# EAGLE schematic hm2_redraw (EAGLE 8.5.1)
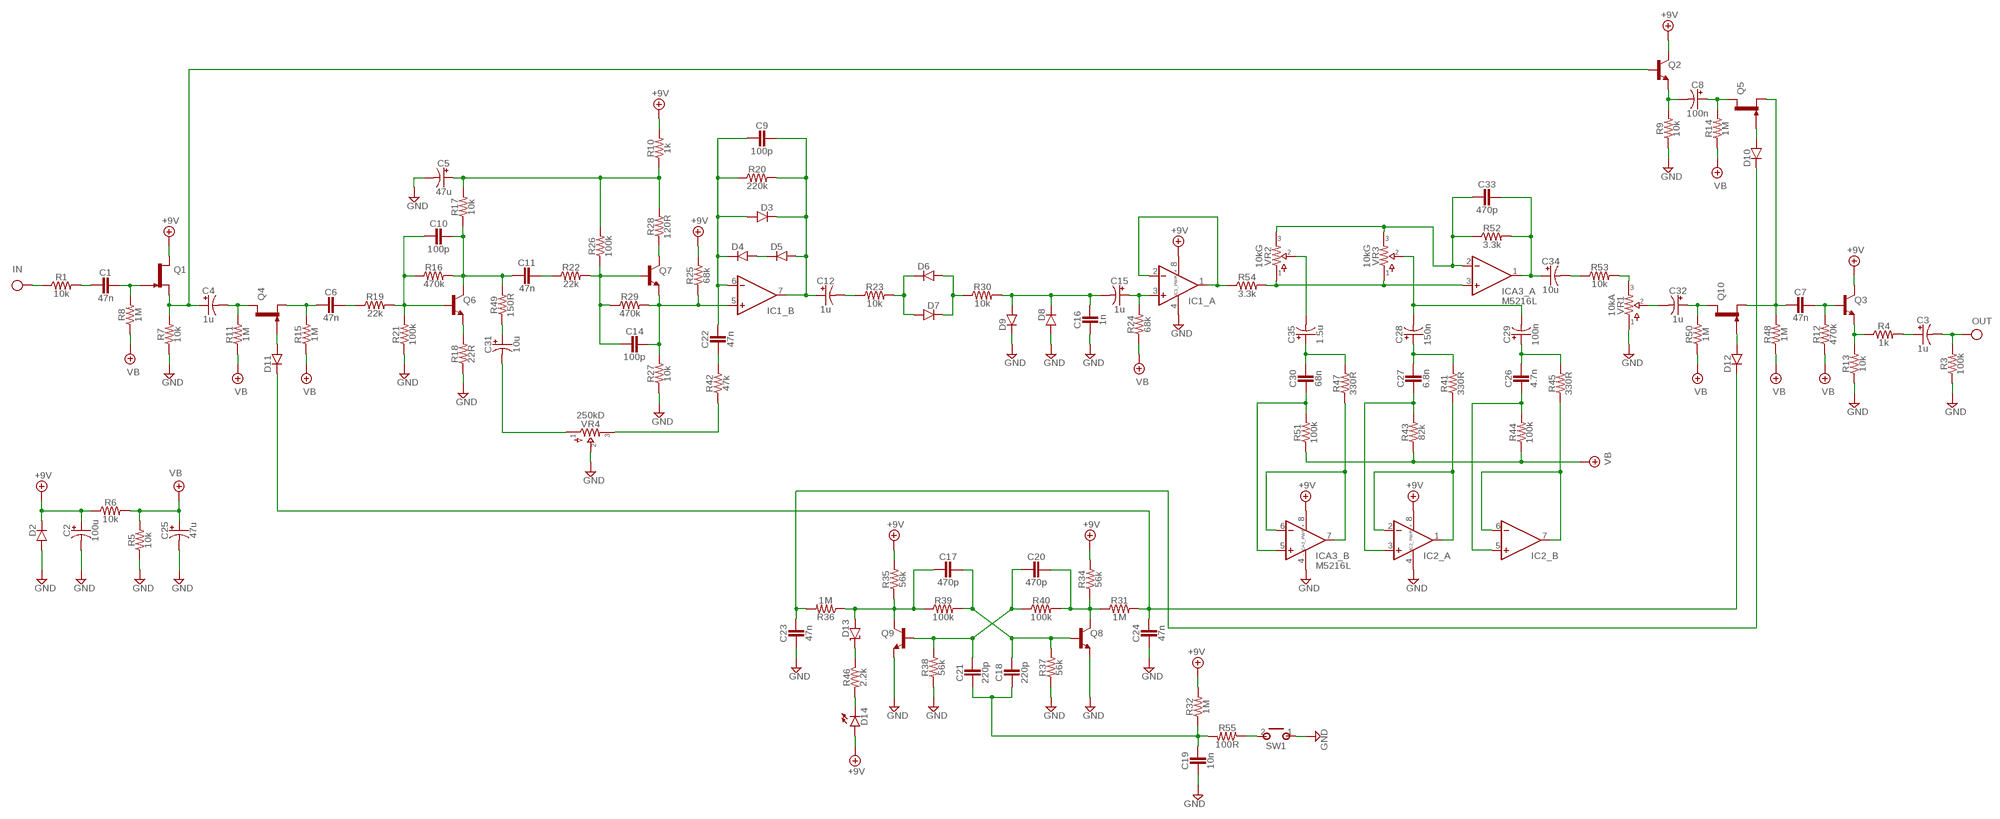
[diagram p0: schematic, sheet 1]

## Parts
C1  47n  CER/FILMBOX.1  [BOX_SMALL]
C2  100u  0400  [040_020]
C3  1u  0400  [040_020]
C4  1u  0400  [040_020]
C5  47u  0400  [040_020]
C6  47n  CER/FILMBOX.1  [BOX_SMALL]
C7  47n  CER/FILMBOX.1  [BOX_SMALL]
C8  100n  0400  [040_020]
C9  100p  CER/FILMBOX.1  [BOX_SMALL]
C10  100p  CER/FILMBOX.1  [BOX_SMALL]
C11  47n  CER/FILMBOX.1  [BOX_SMALL]
C12  1u  0400  [040_020]
C14  100p  CER/FILMBOX.1  [BOX_SMALL]
C15  1u  0400  [040_020]
C16  1n  CER/FILMBOX.1  [BOX_SMALL]
C17  470p  CER/FILMBOX.1  [BOX_SMALL]
C18  220p  CER/FILMBOX.1  [BOX_SMALL]
C19  10n  CER/FILMBOX.1  [BOX_SMALL]
C20  470p  CER/FILMBOX.1  [BOX_SMALL]
C21  220p  CER/FILMBOX.1  [BOX_SMALL]
C22  47n  CER/FILMBOX.1  [BOX_SMALL]
C23  47n  CER/FILMBOX.1  [BOX_SMALL]
C24  47n  CER/FILMBOX.1  [BOX_SMALL]
C25  47u  0400  [040_020]
C26  4.7n  CER/FILMBOX.1  [BOX_SMALL]
C27  6.8n  CER/FILMBOX.1  [BOX_SMALL]
C28  150n  0400  [040_020]
C29  100n  0400  [040_020]
C30  68n  CER/FILMBOX.1  [BOX_SMALL]
C31  10u  0400  [040_020]
C32  1u  0400  [040_020]
C33  470p  CER/FILMBOX.1  [BOX_SMALL]
C34  10u  0400  [040_020]
C35  1.5u  0400  [040_020]
D2  DO35.2  [DO35-2]
D3  DO35.2  [DO35-2]
D4  DO35.2  [DO35-2]
D5  DO35.2  [DO35-2]
D6  DO35.2  [DO35-2]
D7  DO35.2  [DO35-2]
D8  DO35.2  [DO35-2]
D9  DO35.2  [DO35-2]
D10  DO35.2  [DO35-2]
D11  DO35.2  [DO35-2]
D12  DO35.2  [DO35-2]
D13  ZENER.2  [DO41-2]
D14  LED  [3MM_D]
IC1  DUALTH  [DIL0]
IC2  DUALTH  [DIL0]
ICA3  M5216L  DUALTH  [DIL0]
Q1  2N5457  [TO92-]
Q2  2SC828A  [TO92-]
Q3  2SC828A  [TO92-]
Q4  2N5457  [TO92-]
Q5  2N5457  [TO92-]
Q6  2SC828A  [TO92-]
Q7  2SC828A  [TO92-]
Q8  2SC828A  [TO92-]
Q9  2SC828A  [TO92-]
Q10  2N5457  [TO92-]
R1  10k  R_.3B  [R0207/3]
R3  100k  R_.3B  [R0207/3]
R4  1k  R_.3B  [R0207/3]
R5  10k  R_.3B  [R0207/3]
R6  10k  R_.3B  [R0207/3]
R7  10k  R_.3B  [R0207/3]
R8  1M  R_.3B  [R0207/3]
R9  10k  R_.3B  [R0207/3]
R10  1k  R_.3B  [R0207/3]
R11  1M  R_.3B  [R0207/3]
R12  470k  R_.3B  [R0207/3]
R13  10k  R_.3B  [R0207/3]
R14  1M  R_.3B  [R0207/3]
R15  1M  R_.3B  [R0207/3]
R16  470k  R_.3B  [R0207/3]
R17  10k  R_.3B  [R0207/3]
R18  22R  R_.3B  [R0207/3]
R19  22k  R_.3B  [R0207/3]
R20  220k  R_.3B  [R0207/3]
R21  100k  R_.3B  [R0207/3]
R22  22k  R_.3B  [R0207/3]
R23  10k  R_.3B  [R0207/3]
R24  68k  R_.3B  [R0207/3]
R25  68k  R_.3B  [R0207/3]
R26  100k  R_.3B  [R0207/3]
R27  10k  R_.3B  [R0207/3]
R28  120R  R_.3B  [R0207/3]
R29  470k  R_.3B  [R0207/3]
R30  10k  R_.3B  [R0207/3]
R31  1M  R_.3B  [R0207/3]
R32  1M  R_.3B  [R0207/3]
R34  56k  R_.3B  [R0207/3]
R35  56k  R_.3B  [R0207/3]
R36  1M  R_.3B  [R0207/3]
R37  56k  R_.3B  [R0207/3]
R38  56k  R_.3B  [R0207/3]
R39  100k  R_.3B  [R0207/3]
R40  100k  R_.3B  [R0207/3]
R41  330R  R_.3B  [R0207/3]
R42  47k  R_.3B  [R0207/3]
R43  82k  R_.3B  [R0207/3]
R44  100k  R_.3B  [R0207/3]
R45  330R  R_.3B  [R0207/3]
R46  2.2k  R_.3B  [R0207/3]
R47  330R  R_.3B  [R0207/3]
R48  1M  R_.3B  [R0207/3]
R49  150R  R_.3B  [R0207/3]
R50  1M  R_.3B  [R0207/3]
R51  100k  R_.3B  [R0207/3]
R52  3.3k  R_.3B  [R0207/3]
R53  10k  R_.3B  [R0207/3]
R54  3.3k  R_.3B  [R0207/3]
R55  100R  R_.3B  [R0207/3]
SW1  MOMENTARY  [SPST]
VR1  10kA  POTS16MM  [16MM]
VR2  10kG  POTS16MM  [16MM]
VR3  10kG  POTS16MM  [16MM]
VR4  250kD  POTS16MM  [16MM]

## Nets
+9V: C2.+ D2.C D14.ANODE(A) IC1.8(_PWR:V+) IC2.8(_PWR:V+) ICA3.8(_PWR:V+) Q1.3(D) Q2.2(C) Q3.2(C) R6.1 R10.2 R25.2 R32.2 R34.2 R35.2
GND: C2.- C5.- C16.2 C19.2 C23.2 C24.2 C25.- D2.A D8.A D9.C IC1.4(_PWR:V-) IC2.4(_PWR:V-) ICA3.4(_PWR:V-) Q8.3(E) Q9.3(E) R3.1 R5.1 R7.1 R9.1 R13.1 R18.1 R21.1 R27.1 R37.1 R38.1 SW1.1(P) VR1.1 VR4.2
IN: R1.1
N$1: D6.A D7.C R30.1
N$3: C31.- VR4.1
N$4: D10.A Q5.1(G)
N$5: C1.2 R1.2
N$6: C1.1 Q1.1(G) R8.2
N$7: C4.+ Q1.2(S) Q2.1(B) R7.2
N$8: C4.- Q4.3(D) R11.2
N$9: C6.2 Q4.2(S) R15.2
N$10: C6.1 R19.1
N$11: D11.A Q4.1(G)
N$12: C10.2 Q6.1(B) R16.1 R19.2 R21.2
N$13: Q6.3(E) R18.2
N$14: C10.1 C11.2 Q6.2(C) R16.2 R17.1 R49.2
N$15: C5.+ R10.1 R17.2 R26.2 R28.2
N$16: C31.+ R49.1
N$17: C11.1 R22.1
N$18: C14.2 Q7.1(B) R22.2 R26.1 R29.1
N$19: C14.1 IC1.5(_B:+IN) Q7.3(E) R25.1 R27.2 R29.2
N$20: Q7.2(C) R28.1
N$21: C9.2 C22.1 D3.A D4.C IC1.6(_B:-IN) R20.1
N$22: D4.A D5.C
N$23: C9.1 C12.+ D3.C D5.A IC1.7(_B:OUT) R20.2
N$24: R42.1 VR4.3
N$25: C22.2 R42.2
N$30: C12.- R23.1
N$31: C20.1 Q8.2(C) R31.1 R34.1 R40.2
N$32: C20.2 C21.1 Q9.1(B) R38.2 R40.1
N$33: D6.C D7.A R23.2
N$34: C17.1 C18.1 Q8.1(B) R37.2 R39.2
N$36: C15.- C16.1 D8.C D9.A R30.2
N$37: C15.+ IC1.3(_A:+IN) R24.2
N$38: IC1.1(_A:OUT) IC1.2(_A:-IN) R54.1
N$39: ICA3.3(_A:+IN) R54.2 VR2.1 VR3.1
N$40: C33.2 ICA3.2(_A:-IN) R52.1 VR2.3 VR3.3
N$41: C33.1 C34.+ ICA3.1(_A:OUT) R52.2
N$42: C34.- R53.1
N$43: R53.2 VR1.3
N$44: C32.- VR1.2
N$45: C32.+ Q10.3(D) R50.2
N$46: C17.2 D13.A Q9.2(C) R35.1 R36.1 R39.1
N$47: C7.1 Q3.1(B) R12.2
N$48: D12.A Q10.1(G)
N$49: Q3.3(E) R4.1 R13.2
N$50: C3.+ R4.2
N$52: ICA3.6(_B:-IN) ICA3.7(_B:OUT) R47.1
N$53: C23.1 D10.C R36.2
N$54: C30.1 C35.+ R47.2
N$55: C30.2 ICA3.5(_B:+IN) R51.2
N$56: C27.1 C28.+ R41.2
N$57: C27.2 IC2.3(_A:+IN) R43.2
N$58: IC2.1(_A:OUT) IC2.2(_A:-IN) R41.1
N$59: C26.1 C29.+ R45.2
N$60: C26.2 IC2.5(_B:+IN) R44.2
N$61: IC2.6(_B:-IN) IC2.7(_B:OUT) R45.1
N$62: C28.- C29.- VR3.2
N$63: C8.- Q2.3(E) R9.2
N$64: C8.+ Q5.3(D) R14.2
N$66: C24.1 D11.C D12.C R31.2
N$67: C35.- VR2.2
N$68: D13.C R46.1
N$69: D14.P$1(C) R46.2
N$70: R55.1 SW1.2(S)
N$71: C18.2 C19.1 C21.2 R32.1 R55.2
N$73: C7.2 Q5.2(S) Q10.2(S) R48.2
OUT: C3.- R3.2
VB: C25.+ R5.2 R6.2 R8.1 R11.1 R12.1 R14.1 R15.1 R24.1 R43.1 R44.1 R48.1 R50.1 R51.1

## Library data of the parts
C1 C6 C7 C9-C11 C14 C16-C24 C26 C27 C30 C33 = pedals-capacitors-film:CER/FILM: 47 - 120pF Xicon Ceramic Disc 2.5mm lead spacing
C2-C5 C8 C12 C15 C25 C28 C29 C31 C32 C34 C35 = pedals-capacitors-elec:040
D2-D12 = pedals-diodes:DO35: DO-35 Package Diodes: 1N914
D13 = pedals-diodes:ZENER
D14 = pedals-diodes:LED
IC1 IC2 ICA3 = pedals-integrated circuits:DUAL: OP AMP
Q1 Q4 Q5 Q10 = pedals-transistors:2N5457: N-CHANNEL JFET
Q2 Q3 Q6-Q9 = pedals-transistors:2SC828A
R1 R3-R32 R34-R55 = pedals-resistors:R_
SW1 = pedals-switches:MOMENTARY
VR1-VR4 = pedals-potentiometers:POTS